# EAGLE schematic Main (EAGLE 9.6.2)

## Sheet 1 of 5: Central MCU
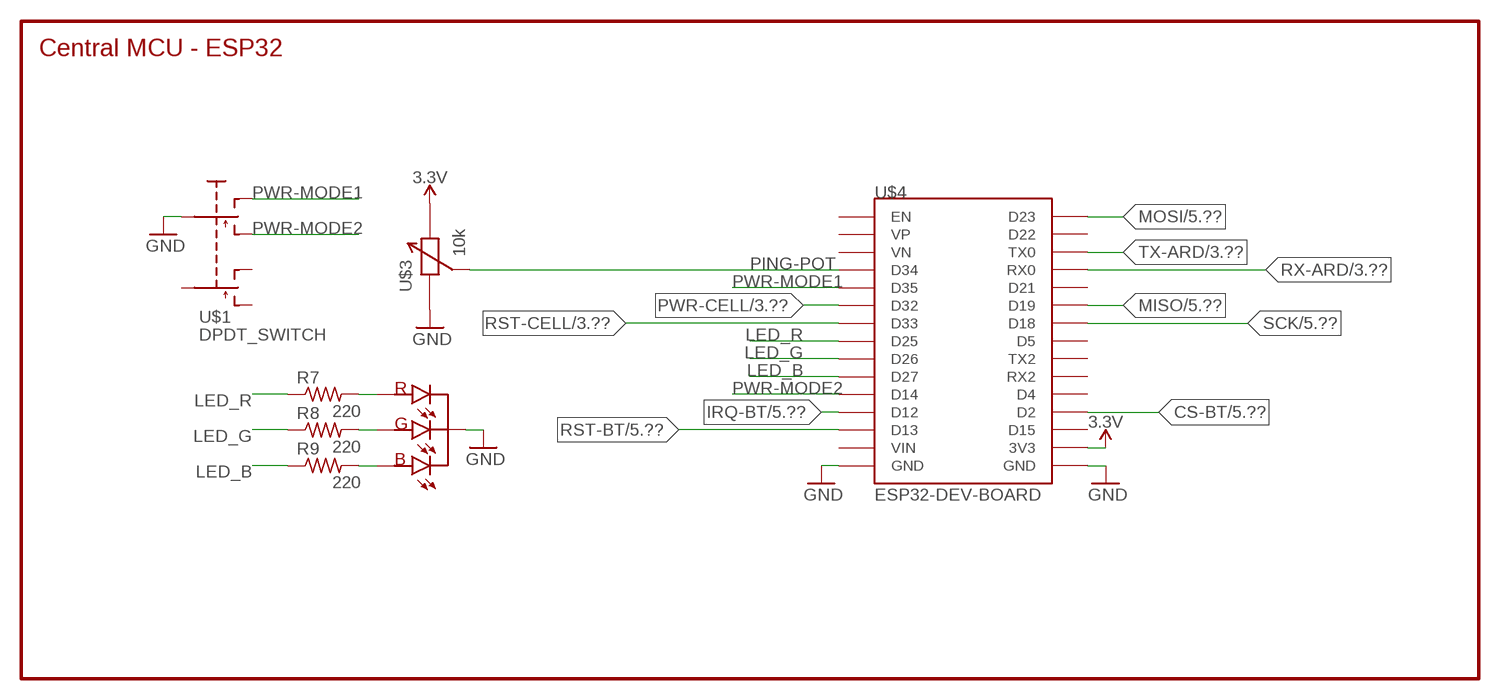
[diagram p0: schematic, sheet 1]

### Parts
R7  220  R-US_R1206  [R1206]
R8  220  R-US_R1206  [R1206]
R9  220  R-US_R1206  [R1206]
U$1  DPDT_SWITCH  [UX0344_DPDT]
U$2  RGBLED_THRU  [RGBLED_THRU]
U$3  10k  POTENTIOMETER  [WH148_POTENTIOMETER]
U$4  ESP32-DEV-BOARD  (no package)

### Nets
3.3V: U$3.P$2 U$4.3V3 ; also sheet 2,3,4,5
CS-BT: U$4.D2 ; also sheet 5
GND: U$1.P$2(P) U$2.P$2 U$3.P$3 U$4.GND ; also sheet 2,3,4,5
IRQ-BT: U$4.D12 ; also sheet 5
LED_B: R9.1 U$4.D27
LED_G: R8.1 U$4.D26
LED_R: R7.1 U$4.D25
MISO: U$4.D19 ; also sheet 5
MOSI: U$4.D23 ; also sheet 5
N$3: R7.2 U$2.P$1
N$4: R8.2 U$2.P$3
N$5: R9.2 U$2.P$4
PING-POT: U$3.P$1 U$4.D34
PWR-CELL: U$4.D32 ; also sheet 3
PWR-MODE1: U$1.P$1(O) U$4.D35
PWR-MODE2: U$1.P$3(S) U$4.D14
RST-BT: U$4.D13 ; also sheet 5
RST-CELL: U$4.D33 ; also sheet 3
RX-ARD: U$4.RX0 ; also sheet 3
SCK: U$4.D18 ; also sheet 5
TX-ARD: U$4.TX0 ; also sheet 3
Unconnected: U$1.P$4(S1) U$1.P$5(P1) U$1.P$6(O1) U$4.D4 U$4.D5 U$4.D15 U$4.D21 U$4.D22 U$4.EN U$4.RX2 U$4.TX2 U$4.VIN U$4.VN U$4.VP

### Notes on the sheet
- Central MCU - ESP32

## Sheet 2 of 5: Power Management
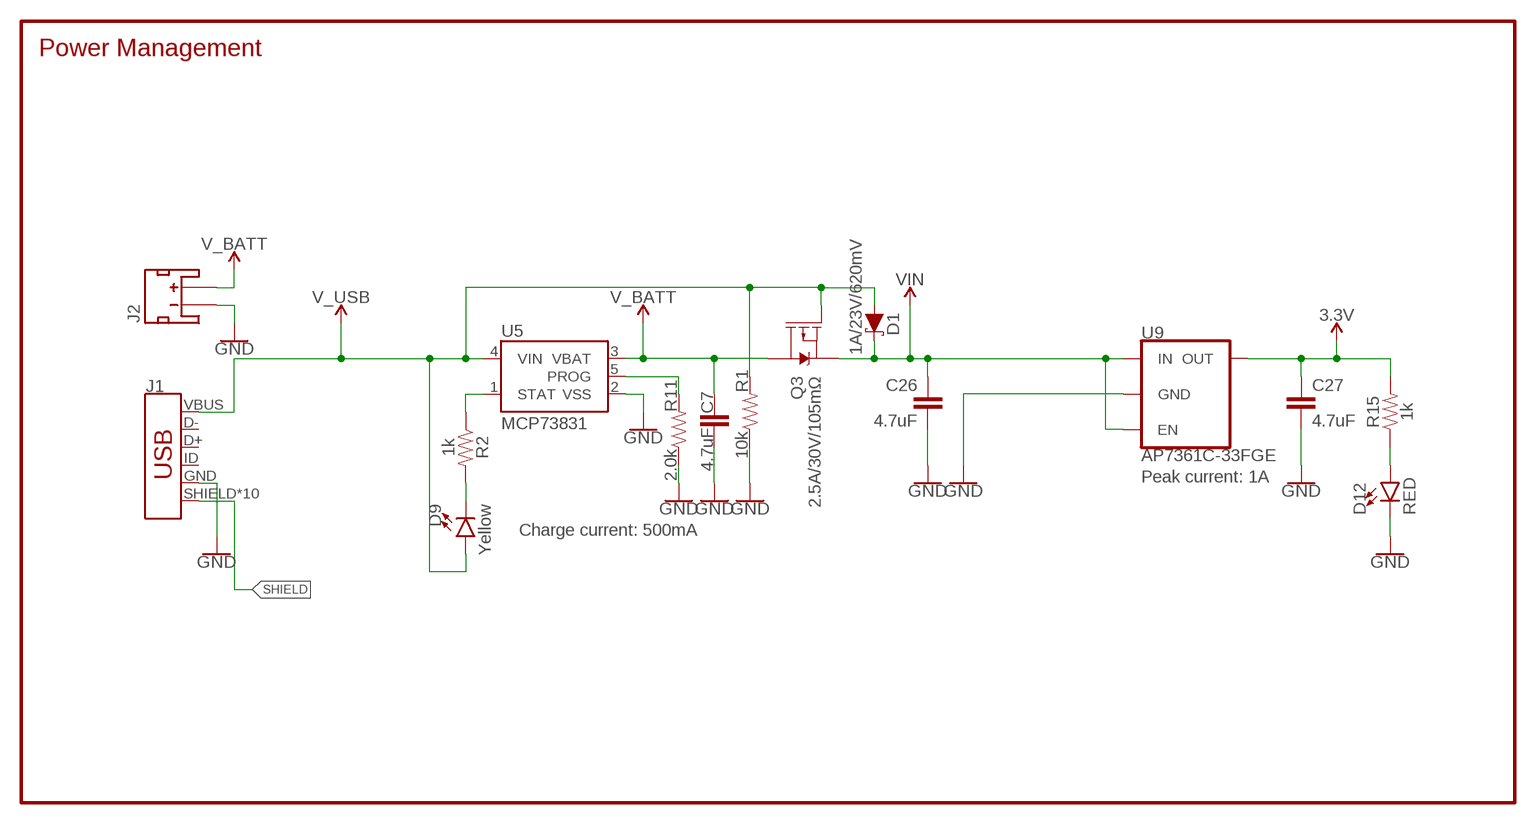
[diagram p1: schematic, sheet 2]

### Parts
C7  4.7uF  4.7UF-0603-6.3V-(10%)  [0603]
C26  4.7uF  4.7UF-0603-6.3V-(10%)  [0603]
C27  4.7uF  4.7UF-0603-6.3V-(10%)  [0603]
D1  1A/23V/620mV  DIODE-SCHOTTKY-BAT20J  [SOD-323]
D9  Yellow  LED-YELLOW0603  [LED-0603]
D12  RED  LED-RED0603  [LED-0603]
J1  USB_MICRO-B_HALF_PTH_MILL  [USB-MICROB-PTH-MILL]
J2  JST_2MM_MALESMD  [JST-2-SMD]
Q3  2.5A/30V/105mΩ  MOSFET_PCH-DMG2307L  [SOT23-3]
R1  10k  10KOHM-0603-1/10W-1%  [0603]
R2  1k  1KOHM-0603-1/10W-1%  [0603]
R11  2.0k  2.0KOHM-0603-1/10W-5%  [0603]
R15  1k  1KOHM-0603-1/10W-1%  [0603]
U5  MCP73831  [SOT23-5]
U9  AP7361C-33FGE  [8-UDFN]

### Nets
3.3V: C27.1 R15.2 U9.1(OUT) ; also sheet 1,3,4,5
GND: C7.2 C26.2 C27.2 D12.C J1.GND J2.1(-) R1.1 R11.1 U5.2(VSS) U9.4(GND) U9.EP(GND) ; also sheet 1,3,4,5
N$1: D9.C R2.2
N$6: R2.1 U5.1(STAT)
N$10: R11.2 U5.5(PROG)
N$11: D12.A R15.1
SHIELD: J1.SHIELD J1.SHIELD2(SHIELD) J1.SHIELD3(SHIELD) J1.SHIELD4(SHIELD) J1.SHIELD5(SHIELD) J1.SHIELD6(SHIELD) J1.SHIELD7(SHIELD) J1.SHIELD8(SHIELD) J1.SHIELD9(SHIELD) J1.SHIELD10(SHIELD)
V_BATT: C7.1 J2.2(+) Q3.3(D) U5.3(VBAT)
V_USB: D1.A D9.A J1.VBUS Q3.1(G) R1.2 U5.4(VIN)
VIN: C26.1 D1.C Q3.2(S) U9.5(EN) U9.8(IN)
Unconnected: J1.D+ J1.D- J1.ID

### Notes on the sheet
- Power Management
- Peak current: 1A
- Charge current: 500mA

## Sheet 3 of 5: Cellular Module Main
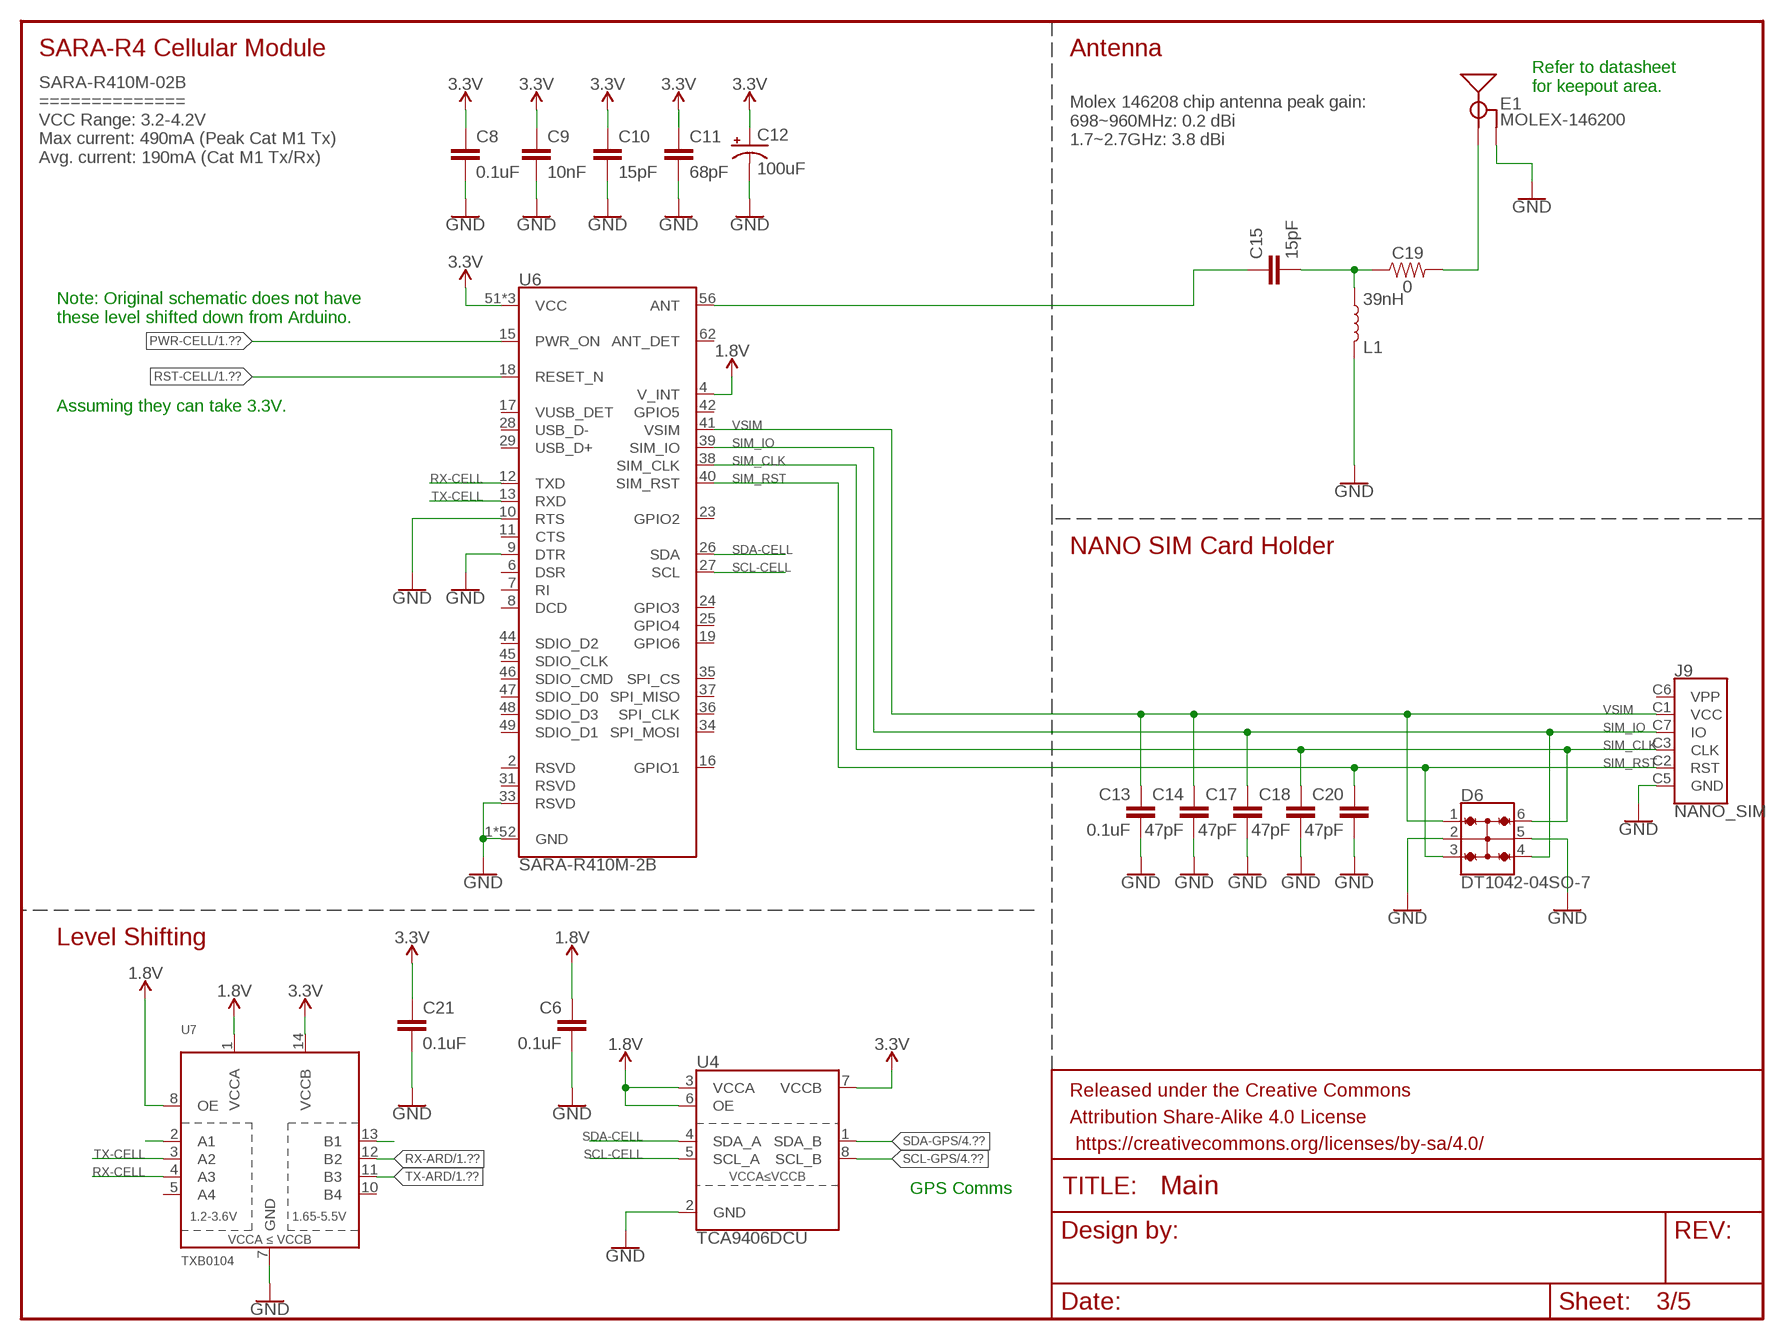
[diagram p2: schematic, sheet 3]

### Parts
C6  0.1uF  0.1UF-0603-25V-(+80/-20%)  [0603]
C8  0.1uF  0.1UF-0603-25V-(+80/-20%)  [0603]
C9  10nF  10NF-0603-50V-10%  [0603]
C10  15pF  15PF-0603-50V-5%  [0603]
C11  68pF  68PF-0603-50V-5%  [0603]
C12  100uF  100UF-POLAR-1206-6.3V-20%  [1206-POLAR]
C13  0.1uF  0.1UF-0603-25V-(+80/-20%)  [0603]
C14  47pF  47PF-0603-50V-5%  [0603]
C15  15pF  15PF-0603-50V-5%  [0603]
C17  47pF  47PF-0603-50V-5%  [0603]
C18  47pF  47PF-0603-50V-5%  [0603]
C19  0  0OHM-0603-1/10W-5%  [0603]
C20  47pF  47PF-0603-50V-5%  [0603]
C21  0.1uF  0.1UF-0603-25V-(+80/-20%)  [0603]
D6  DT1042-04SO-7  TVS_DIODE_ARRAY_4DT1042-04SO-7  [SOT23-6L]
E1  MOLEX-146200  ANTENNA-GROUNDEDMOLEX-146200  [MOLEX_146200]
FRAME2  FRAME-LETTER  [CREATIVE_COMMONS]
J9  NANO_SIM  NANO_SIMWURTH  [NANO_SIM_WURTH_693043020611]
L1  39nH  INDUCTOR-0603-39NH  [0603]
U4  TCA9406DCU  [VSSOP-8]
U6  SARA-R410M-2B  SARA-R4  [SARA-LGA]
U7  TXB0104  TXB0104PWR  [TSSOP14]

### Nets
1.8V: C6.1 U4.3(VCCA) U4.6(OE) U6.4(V_INT) U7.1(VCCA) U7.8(OE)
3.3V: C8.1 C9.1 C10.1 C11.1 C12.1(+) C21.1 U4.7(VCCB) U6.51(VCC) U6.52(VCC) U6.53(VCC) U7.14(VCCB) ; also sheet 1,2,4,5
ANT: C15.1 U6.56(ANT)
GND: C6.2 C8.2 C9.2 C10.2 C11.2 C12.2(-) C13.2 C14.2 C17.2 C18.2 C20.2 C21.2 D6.2 D6.5 E1.GND J9.C5(GND) L1.1 U4.2(GND) U6.1(GND) U6.3(GND) U6.5(GND) U6.9(DTR) U6.10(RTS) U6.14(GND) U6.20(GND) U6.21(GND) U6.22(GND) U6.30(GND) U6.32(GND) U6.33(RSVD) U6.43(GND) U6.50(GND) U6.54(GND) U6.55(GND) U6.57(GND) U6.58(GND) U6.59(GND) U6.60(GND) U6.61(GND) U6.63(GND) U6.64(GND) U6.65(GND) U6.66(GND) U6.67(GND) U6.68(GND) U6.69(GND) U6.70(GND) U6.71(GND) U6.72(GND) U6.73(GND) U6.74(GND) U6.75(GND) U6.76(GND) U6.77(GND) U6.78(GND) U6.79(GND) U6.80(GND) U6.81(GND) U6.82(GND) U6.83(GND) U6.84(GND) U6.85(GND) U6.86(GND) U6.87(GND) U6.88(GND) U6.89(GND) U6.90(GND) U6.91(GND) U6.92(GND) U6.93(GND) U6.94(GND) U6.95(GND) U6.96(GND) U7.7(GND) ; also sheet 1,2,4,5
GPIO3-CELL1: U7.2(A1)
GPIO3-QWIIC1: U7.13(B1)
N$8: C15.2 C19.1 L1.2
N$21: C19.2 E1.FEED(SIGNAL)
PWR-CELL: U6.15(PWR_ON) ; also sheet 1
RST-CELL: U6.18(RESET_N) ; also sheet 1
RX-ARD: U7.12(B2) ; also sheet 1
RX-CELL: U6.12(TXD) U7.4(A3)
SCL-CELL: U4.5(SCL_A) U6.27(SCL)
SCL-GPS: U4.8(SCL_B) ; also sheet 4
SDA-CELL: U4.4(SDA_A) U6.26(SDA)
SDA-GPS: U4.1(SDA_B) ; also sheet 4
SIM_CLK: C18.1 D6.6 J9.C3(CLK) U6.38(SIM_CLK)
SIM_IO: C17.1 D6.4 J9.C7(IO) U6.39(SIM_IO)
SIM_RST: C20.1 D6.3 J9.C2(RST) U6.40(SIM_RST)
TX-ARD: U7.11(B3) ; also sheet 1
TX-CELL: U6.13(RXD) U7.3(A2)
VSIM: C13.1 C14.1 D6.1 J9.C1(VCC) U6.41(VSIM)
Unconnected: J9.C6(VPP) U6.2(RSVD) U6.6(DSR) U6.7(RI) U6.8(DCD) U6.11(CTS) U6.16(GPIO1) U6.17(VUSB_DET) U6.19(GPIO6) U6.23(GPIO2) U6.24(GPIO3) U6.25(GPIO4) U6.28(USB_D-) U6.29(USB_D+) U6.31(RSVD) U6.34(SPI_MOSI) U6.35(SPI_CS) U6.36(SPI_CLK) U6.37(SPI_MISO) U6.42(GPIO5) U6.44(SDIO_D2) U6.45(SDIO_CLK) U6.46(SDIO_CMD) U6.47(SDIO_D0) U6.48(SDIO_D3) U6.49(SDIO_D1) U6.62(ANT_DET) U7.5(A4) U7.10(B4)

### Notes on the sheet
- SARA-R4 Cellular Module | Antenna
- Refer to datasheet
  for keepout area.
- Molex 146208 chip antenna peak gain: 
  698~960MHz: 0.2 dBi
  1.7~2.7GHz: 3.8 dBi
- SARA-R410M-02B
  ==============
  VCC Range: 3.2-4.2V
  Max current: 490mA (Peak Cat M1 Tx)
  Avg. current: 190mA (Cat M1 Tx/Rx)
- Note: Original schematic does not have
  these level shifted down from Arduino.
- Assuming they can take 3.3V.
- NANO SIM Card Holder
- Level Shifting
- GPS Comms

## Sheet 4 of 5: GPS Module
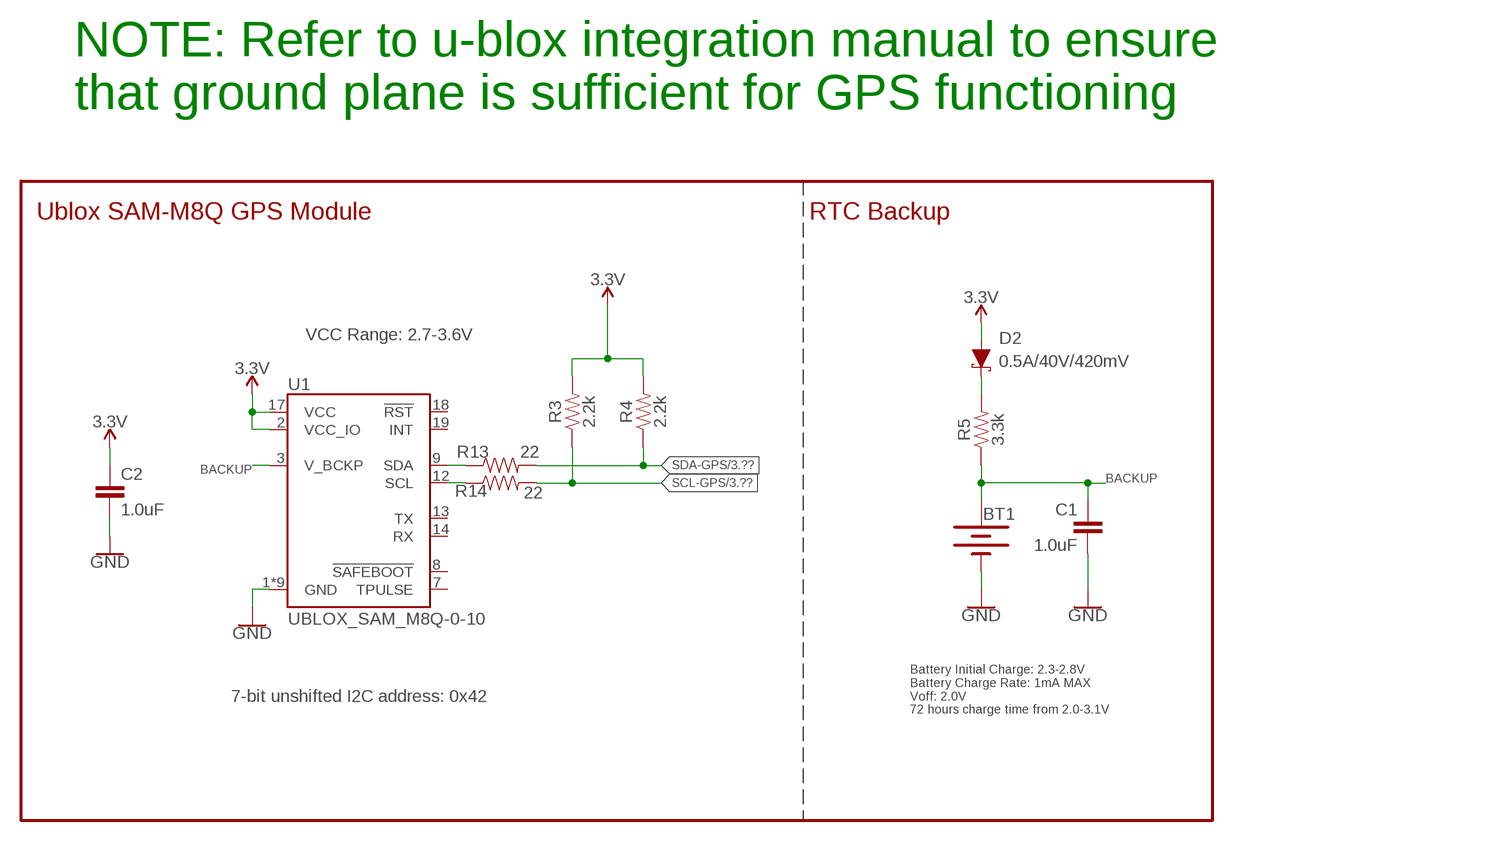
[diagram p3: schematic, sheet 4]

### Parts
BT1  6.8MM_COIN_CELL  ML414H_IV01E_BATTERY  [ML414H_IV01E]
C1  1.0uF  1.0UF-0603-16V-10%  [0603]
C2  1.0uF  1.0UF-0603-16V-10%  [0603]
D2  0.5A/40V/420mV  DIODE-SCHOTTKY-PMEG4005EJ  [SOD-323]
R3  2.2k  2.2KOHM-0603-1/10W-1%  [0603]
R4  2.2k  2.2KOHM-0603-1/10W-1%  [0603]
R5  3.3k  3.3KOHM-0603-1/10W-1%  [0603]
R13  22  22OHM-0603-1/10W-1%  [0603]
R14  22  22OHM-0603-1/10W-1%  [0603]
U1  UBLOX_SAM_M8Q-0-10  [SAM-M8Q]

### Nets
3.3V: C2.1 D2.A R3.2 R4.2 U1.2(VCC_IO) U1.17(VCC) ; also sheet 1,2,3,5
BACKUP: BT1.+ C1.1 R5.1 U1.3(V_BCKP)
GND: BT1.- C1.2 C2.2 U1.1(GND) U1.4(GND) U1.5(GND) U1.6(GND) U1.10(GND) U1.11(GND) U1.15(GND) U1.16(GND) U1.20(GND) ; also sheet 1,2,3,5
N$16: D2.C R5.2
SCL-GPS: R3.1 R14.2 ; also sheet 3
SCL_LV: R14.1 U1.12(SCL)
SDA-GPS: R4.1 R13.2 ; also sheet 3
SDA_LV: R13.1 U1.9(SDA)
Unconnected: U1.7(TPULSE) U1.8(!SAFEBOOT) U1.13(TX) U1.14(RX) U1.18(!RST) U1.19(INT)

### Notes on the sheet
- NOTE: Refer to u-blox integration manual to ensure
  that ground plane is sufficient for GPS functioning
- Ublox SAM-M8Q GPS Module | RTC Backup
- VCC Range: 2.7-3.6V
- 7-bit unshifted I2C address: 0x42
- Battery Initial Charge: 2.3-2.8V
  Battery Charge Rate: 1mA MAX
  Voff: 2.0V
  72 hours charge time from 2.0-3.1V

## Sheet 5 of 5: Bluetooth Module
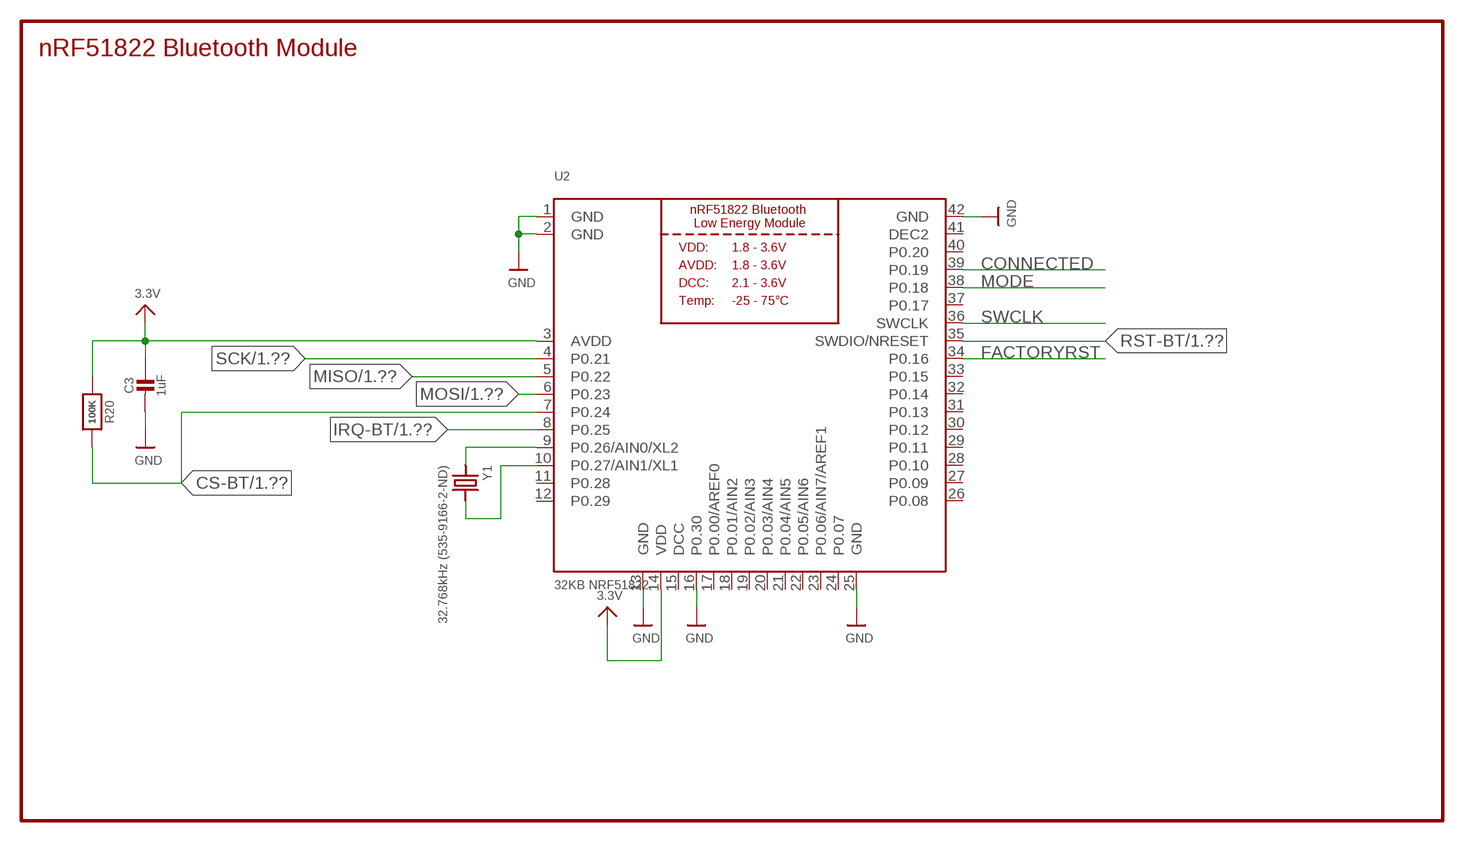
[diagram p4: schematic, sheet 5]

### Parts
C3  1uF  CAP_CERAMIC0805_10MGAP  [0805_10MGAP]
R20  100K  RESISTOR_0805MP  [_0805MP]
U2  32KB NRF51822  NRF51822_MODULE_MDBT40  [BLE_MODULE_RAYTAC_MDBT40]
Y1  32.768kHz (535-9166-2-ND)  CRYSTAL2.0X6.0_32.768  [CRYSTAL_CYL_2X6MM_SMT]

### Nets
3.3V: C3.1 R20.1 U2.3(AVDD) U2.14(VDD) ; also sheet 1,2,3,4
CONNECTED: U2.39(P0.19)
CS-BT: R20.2 U2.7(P0.24) ; also sheet 1
FACTORYRST: U2.34(P0.16)
GND: C3.2 U2.1(GND) U2.2(GND) U2.13(GND) U2.16(P0.30) U2.25(GND) U2.42(GND) ; also sheet 1,2,3,4
IRQ-BT: U2.8(P0.25) ; also sheet 1
MISO: U2.5(P0.22) ; also sheet 1
MODE: U2.38(P0.18)
MOSI: U2.6(P0.23) ; also sheet 1
N$23: U2.9(P0.26/AIN0/XL2) Y1.1
N$24: U2.10(P0.27/AIN1/XL1) Y1.2
RST-BT: U2.35(SWDIO/NRESET) ; also sheet 1
SCK: U2.4(P0.21) ; also sheet 1
SWCLK: U2.36(SWCLK)
Unconnected: U2.11(P0.28) U2.12(P0.29) U2.17(P0.00/AREF0) U2.18(P0.01/AIN2) U2.19(P0.02/AIN3) U2.20(P0.03/AIN4) U2.21(P0.04/AIN5) U2.22(P0.05/AIN6) U2.23(P0.06/AIN7/AREF1) U2.24(P0.07) U2.26(P0.08) U2.27(P0.09) U2.28(P0.10) U2.29(P0.11) U2.30(P0.12) U2.31(P0.13) U2.32(P0.14) U2.33(P0.15) U2.37(P0.17) U2.40(P0.20)

### Notes on the sheet
- nRF51822 Bluetooth Module

## Power pins joined to a net without a drawn wire
DCC: U2.15(DCC)
DEC2: U2.41(DEC2)

## Library data of the parts
BT1 = SparkFun-Batteries:ML414H_IV01E_BATTERY: SEIKO ML414H-IV01E Reflowable Lithium Battery ML414H is a rechargeable, coin type battery with features such as Pb-free reflowable (Peak temperature: 260 C) and high temperature heat resistance. Battery Characteristics: 3.1V max voltage Voff is 2V 1mAH 3k series resistor with battery 72 hour charge time from 2.0-3.1V 2.3-2.8V initial charge; PROD_ID: BATT-14267
C1 C2 = SparkFun-Capacitors:1.0UF: 1µF ceramic capacitors A capacitor is a passive two-terminal electrical component used to store electrical energy temporarily in an electric field.; PROD_ID: CAP-00868
C3 = microbuilder:CAP_CERAMIC: Ceramic Capacitors For new designs, use the packages preceded by an '_' character since they are more reliable: The following footprints should be used on most boards: _0402 - Standard footprint for regular board layouts _0603 - Standard footprint for regular board layouts _0805 - Standard footprint for regular board layouts _1206 - Standard footprint for regular board layouts For extremely tight-pitch boards where space is at a premium, the following 'micro-pitch' footprints can be used (smaller pads, no silkscreen outline, etc.): _0402MP - Micro-pitch footprint for very dense/compact boards _0603MP - Micro-pitch footprint for very dense/compact boards _0805MP - Micro-pitch footprint for very dense/compact boards _1206MP - Micro-pitch footprint for very dense/compact boards
C6 C8 C13 C21 = SparkFun-Capacitors:0.1UF: 0.1µF ceramic capacitors A capacitor is a passive two-terminal electrical component used to store electrical energy temporarily in an electric field.; PROD_ID: CAP-00810
C7 C26 C27 = SparkFun-Capacitors:4.7UF: 4.7µF ceramic capacitors A capacitor is a passive two-terminal electrical component used to store electrical energy temporarily in an electric field.; PROD_ID: CAP-08280
C9 = SparkFun-Capacitors:10NF: 0.01uF/10nF/10,000pF ceramic capacitors A capacitor is a passive two-terminal electrical component used to store electrical energy temporarily in an electric field. CAP-09321; PROD_ID: CAP-00867
C10 C15 = SparkFun-Capacitors:15PF: 15pF ceramic capacitors A capacitor is a passive two-terminal electrical component used to store electrical energy temporarily in an electric field.; PROD_ID: CAP-07881
C11 = ublox:68PF: 68pF ceramic capacitors A capacitor is a passive two-terminal electrical component used to store electrical energy temporarily in an electric field.; PROD_ID: CAP-14092
C12 = ublox:100UF-POLAR: 100µF polarized capacitors A capacitor is a passive two-terminal electrical component used to store electrical energy temporarily in an electric field.; PROD_ID: CAP-14093
C14 C17 C18 C20 = SparkFun-Capacitors:47PF: 47pF ceramic capacitors A capacitor is a passive two-terminal electrical component used to store electrical energy temporarily in an electric field.; PROD_ID: CAP-08913
C19 = SparkFun-Resistors:0OHM: 0Ω resistor A resistor is a passive two-terminal electrical component that implements electrical resistance as a circuit element. Resistors act to reduce current flow, and, at the same time, act to lower voltage levels within circuits. - Wikipedia; PROD_ID: RES-08609
D1 = SparkFun-DiscreteSemi:DIODE-SCHOTTKY: Schottky diode A Schottky diode is a semiconductor diode which has a low forward voltage drop and a very fast switching action.; PROD_ID: DIO-11623
D2 = SparkFun-DiscreteSemi:DIODE-SCHOTTKY: Schottky diode A Schottky diode is a semiconductor diode which has a low forward voltage drop and a very fast switching action.; PROD_ID: DIO-10955
D6 = ublox:TVS_DIODE_ARRAY_4; PROD_ID: DIO-14095
D9 = SparkFun-LED:LED-YELLOW: Yellow SMD LED Used in manufacturing several products at SparkFun. Packages: 0603 - SMD 0603 package[Product Link] <http://www.kingbrightusa.com/product.asp?catalog_name=LED&product_id=APT1608SYCK> 0603 -SMART - SMART SMD 0603 package (more efficient/more expensive) [Product Link] <http://www.osram-os.com/osram_os/en/products/product-catalog/led-light-emitting-diodes/smartled-0603/ly-l29k/index.jsp> LilyPad - SMD1206 package[Product Datasheet] <https://www.sparkfun.com/datasheets/DevTools/LilyPad/Q150YUS4.pdf> SparkFun Products: Blynk Board <https://www.sparkfun.com/products/13794> IOIO-OTG <https://www.sparkfun.com/products/13613> XBee Explorer Serial <https://www.sparkfun.com/products/13225>; PROD_ID: DIO-09003
D12 = SparkFun-LED:LED-RED: Red SMD LED Used in manufacturing of most products at SparkFun Packages: 0603 - SMD 0603 package [Product Link] <http://docs.avagotech.com/docs/AV02-0551EN> 0603 SMART - SMD 0603 SMART package ( more efficient and expensive)[Product Link] <http://www.osram-os.com/Graphics/XPic2/00077099_0.pdf> 1206 - SMD1206 package [Product Link] <https://www.sparkfun.com/datasheets/DevTools/LilyPad/Q150OVS4.pdff> SparkFun Products: Pro Mini 328 -5V <https://www.sparkfun.com/products/821> RedBoard <https://www.sparkfun.com/products/12757> IOIO-OTG <https://www.sparkfun.com/products/13613>; PROD_ID: DIO-00819
E1 = ublox:ANTENNA-GROUNDED: Antenna w/ Ground Connection 2.4GHz antennae with signal and ground terminals. TRACE_ANTENNA_2.4GHZ_15.2MM - Meander Trace antenna 15.2 x 5.7mm footprint Based on layout from TI app note AN043 <http://www.ti.com/lit/an/swra117d/swra117d.pdf>. TRACE_ANTENNA_2.4GHZ_25.7MM - Inverted F trace antenna 25.7 x 7.5 mm footprint. Based on layout from TI design note DN0007 <http://www.ti.com/lit/an/swru120b/swru120b.pdf>.; PROD_ID: ANT-14096
FRAME2 = SparkFun-Aesthetics:FRAME-LETTER: Schematic Frame - Letter Standard 8.5x11 US Letter frame
J1 = SparkFun-Connectors:USB_MICRO-B: USB Type Micro-B Connector Male/female and PTH/SMT variants SparkFun Products: SparkFun microB USB Breakout <https://www.sparkfun.com/products/12035> SparkFun USB microB Plug Breakout <https://www.sparkfun.com/products/10031> SparkFun ESP8266 Thing <https://www.sparkfun.com/products/13231>; PROD_ID: CONN-13711
J2 = SparkFun-Connectors:JST_2MM_MALE: JST 2MM MALE RA CONNECTOR Two pin, compact surface mount connector. Commonly used as a battery input connection point. We really like the solid locking feeling and high current rating on these small connectors. We use these all the time as battery connectors. Mates to single-cell LiPo batteries. Here is the connector we sell at SparkFun: JST Right Angle Connector - White <https://www.sparkfun.com/products/8612> (PRT-08612) Datasheet <http://www.sparkfun.com/datasheets/Prototyping/Connectors/JST-Horizontal.pdf> It was used on these SparkFun products: SparkFun MOSFET Power Controller <https://www.sparkfun.com/products/11214> (PRT-11214) SparkFun Battery Babysitter - LiPo Battery Manager <https://www.sparkfun.com/products/13777> (PRT-13777) And many, many others that required a lipo battery connection.; PROD_ID: CONN-11443; SF_ID: PRT-08612
J9 = ublox:NANO_SIM; PROD_ID: CONN-14097
L1 = ublox:INDUCTOR: Inductors Resist changes in electrical current. Basically a coil of wire. SparkFun Products: SparkFun Load Cell Amplifier - HX711 <https://www.sparkfun.com/products/13879> IOIO-OTG - V2.2 <https://www.sparkfun.com/products/13613>; PROD_ID: NDUC-14091
Q3 = SparkFun-DiscreteSemi:MOSFET_PCH: P-channel MOSFETs Voltage controlled devices that allow control of high current outputs. SparkFun Products: SparkFun ESP32 Thing <https://www.sparkfun.com/products/13907> SparkFun ESP8266 Thing <https://www.sparkfun.com/products/13231>; PROD_ID: TRANS-11308
R1 = SparkFun-Resistors:10KOHM: 10kΩ resistor A resistor is a passive two-terminal electrical component that implements electrical resistance as a circuit element. Resistors act to reduce current flow, and, at the same time, act to lower voltage levels within circuits. - Wikipedia; PROD_ID: RES-00824
R2 R15 = SparkFun-Resistors:1KOHM: 1kΩ resistor A resistor is a passive two-terminal electrical component that implements electrical resistance as a circuit element. Resistors act to reduce current flow, and, at the same time, act to lower voltage levels within circuits. - Wikipedia; PROD_ID: RES-07856
R3 R4 = SparkFun-Resistors:2.2KOHM: 2.2kΩ resistor A resistor is a passive two-terminal electrical component that implements electrical resistance as a circuit element. Resistors act to reduce current flow, and, at the same time, act to lower voltage levels within circuits. - Wikipedia; PROD_ID: RES-08272
R5 = SparkFun-Resistors:3.3KOHM: 3.3kΩ resistor A resistor is a passive two-terminal electrical component that implements electrical resistance as a circuit element. Resistors act to reduce current flow, and, at the same time, act to lower voltage levels within circuits. - Wikipedia; PROD_ID: RES-07851
R7-R9 = rcl:R-US_: RESISTOR, American symbol; SPICEPREFIX: R
R11 = SparkFun-Resistors:2.0KOHM: 2kΩ resistor A resistor is a passive two-terminal electrical component that implements electrical resistance as a circuit element. Resistors act to reduce current flow, and, at the same time, act to lower voltage levels within circuits. - Wikipedia; PROD_ID: RES-08296
R13 R14 = SparkFun-Resistors:22OHM: 22Ω resistor A resistor is a passive two-terminal electrical component that implements electrical resistance as a circuit element. Resistors act to reduce current flow, and, at the same time, act to lower voltage levels within circuits. - Wikipedia; PROD_ID: RES-08698
R20 = microbuilder:RESISTOR: Resistors For new designs, use the packages preceded by an '_' character since they are more reliable: The following footprints should be used on most boards: _0402 - Standard footprint for regular board layouts _0603 - Standard footprint for regular board layouts _0805 - Standard footprint for regular board layouts _1206 - Standard footprint for regular board layouts For extremely tight-pitch boards where space is at a premium, the following 'micro-pitch' footprints can be used (smaller pads, no silkscreen outline, etc.): _0402MP - Micro-pitch footprint for very dense/compact boards _0603MP - Micro-pitch footprint for very dense/compact boards _0805MP - Micro-pitch footprint for very dense/compact boards _1206MP - Micro-pitch footprint for very dense/compact boards
U1 = SparkFun-GPS:UBLOX_SAM_M8Q-0-10: u-blox SAM-M8Q The u-blox concurrent SAM-M8Q GNSS patch antenna module benefits from the exceptional performance of the u-blox M8 multi-GNSS engine. The SAM-M8Q module offers high sensitivity and minimal acquisition times in an ultra compact form factor. The SAM-M8Q module utilizes concurrent reception of up to three GNSS systems (GPS/Galileo and GLONASS), recognizes multiple constellations simultaneously and provides outstanding positioning accuracy in scenarios where urban canyon or weak signals are involved. For even better and faster positioning improvement, the SAM-M8Q supports augmentation of QZSS, GAGAN and IMES together with WAAS, EGNOS, MSAS. The SAM-M8Q also supports message integrity protection, geofencing, and spoofing detection with configurable interface settings to easily fit to customer applications.; PROD_ID: IC-14070
U2 = microbuilder:NRF51822_MODULE_MDBT40: nRF51822 Bluetooth Low Energy Module
U4 = ublox:TCA9406; PROD_ID: IC-14098
U5 = SparkFun-PowerIC:MCP73831: Miniature single cell, fully integrated Li-Ion, Li-polymer charge management controller http://ww1.microchip.com/downloads/en/DeviceDoc/21984a.pdf IC-09995; PROD_ID: IC-09995
U6 = ublox:SARA-R4; PROD_ID: IC-14085
U7 = SparkFun-IC-Comms:TXB0104PWR: 4-Bit Bi-Directional Level Shifter 1.2V-3.6V (VCCA) to 1.65V-5.5V (VCCB) bi-directional level shifter with auto direction sensing. Max data rate - VCCA 1.8V: 20Mbps (50ns), VCCA 3.3V: 100Mbps (10ns) Digikey: 296-21929-1-ND (TSSOP) Datasheet <http://cdn.sparkfun.com/datasheets/BreakoutBoards/txb0104.pdf> SparkFun Products SparkFun Cellular Shield - MG2639 <https://www.sparkfun.com/products/13120> (CEL-13120) SparkFun Level Shifting microSD Breakout <https://www.sparkfun.com/products/13743> (DEV-13743) SparkFun Voltage-Level Translator Breakout - TXB0104 <https://www.sparkfun.com/products/11771> (BOB-11771) SparkFun Block for Intel® Edison - UART <https://www.sparkfun.com/products/13040> (DEV-13040) SparkFun Block for Intel® Edison - Arduino <https://www.sparkfun.com/products/13036> (DEV-13036); PROD_ID: IC-13929
U9 = ublox:AP7361C-33FGE: AP7361C 3.3V LDO Regulator; PROD_ID: VREG-14094
U$1 = SeniorDesign:DPDT_SWITCH
U$2 = SeniorDesign:RGBLED_THRU
U$3 = SeniorDesign:POTENTIOMETER
U$4 = SeniorDesign:ESP32-DEV-BOARD
Y1 = microbuilder:CRYSTAL: Crystals HC49UP - Surface Mount Crystal 4.0MHz 18pF +/-30ppm Surface Mount Crystal [Digikey: 535-9857-1-ND] 12.0 MHz Surface Mount Crystal [Digikey: 535-9869-6-ND] 25.0 MHz Surface Mount Crystal [Digikey: 535-9078-1-ND] 2.5 x 2.0mm - MEMs SMT Crystal 16.0 MHz 10pF 20ppm 2.5 x 2.0mm Crystal [Digikey -40-85°C: 535-10923-1-ND] 3.2 x 2.5mm - MEMs SMT Crystal 12.0 MHz 8pF 15ppm 3.2 x 2.5mm Crystal [Digikey: -10-70°C: 644-1047-1-ND -40-125°C: 644-1128-1-ND] 40~85°C cheaper: 644-1173-6-ND 16.0 MHz 8pF 15ppm 3.2 x 2.5mm Crystal [Digikey: -10-70°C: 644-1049-1-ND -40-125°C: 644-1129-2-ND]-40~85°C cheaper: 644-1175-6-ND 16.0 MHz 10pF 10ppm 3.2 x 2.5mm Crystal [Digikey: 644-1100-1-ND] 27.12 MHz 18pF 30ppm 3.2 x 2.5mm Crystal [Digikey: 887-1424-1-ND] 27.12MHz 10pF 10ppm 3.2 x 2.5mm Crystal [Digikey: 887-1329-1-ND] 4.9 x 1.8mm - MEMs SMT Crystal 32.768 KHz 12.5pF 20ppm 4.9 x 1.8mm Crystal [Digikey: SE2415CT-ND] 8.0 x 3.8mm - Surface Mount Crystal 32.768kHz 12.5pF 20ppm -40°C-85°C [Digikey: 535-9166-2-ND] Cylinder 32.768KHz Cylinder Crystal (2x6mm body) [Ex. Digikey: 300-8341-2-ND]

## Net classes
0 default: width 0.254 mm, clearance 0.254 mm
1 power: width 0.61 mm, drill 0.61 mm, clearance 0.254 mm
2 gnd: width 0.305 mm, drill 0.559 mm, clearance 0.254 mm
3 usbvcc: width 0.508 mm, drill 0.61 mm, clearance 0.254 mm
4 aref: width 0.406 mm, drill 0.61 mm, clearance 0.254 mm